# Altium schematic sheet GALX4-0047N_PCB-1109N_REV-A_io_2.SchDoc
size 431 x 279 mm; SheetNumber: 1; SheetTotal: 1; DocumentName: Sheet1.SCHDOC
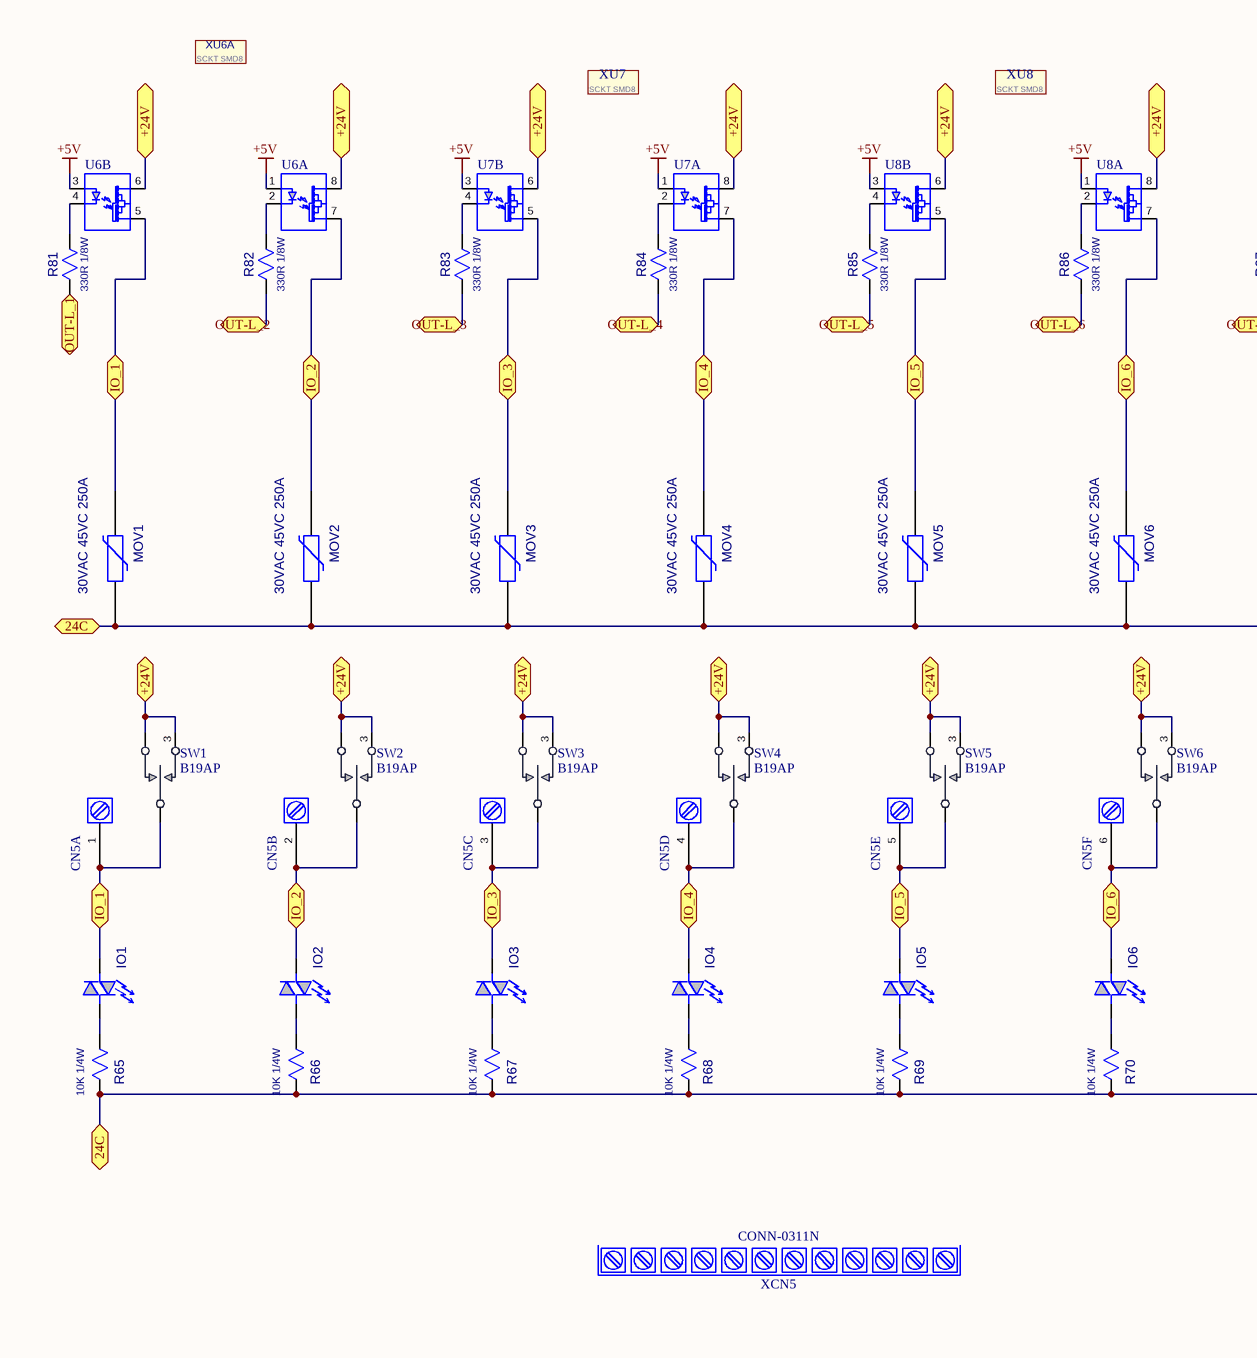
[diagram p0: GALX4-0047N_PCB-1109N_REV-A_io_2.SchDoc, left]
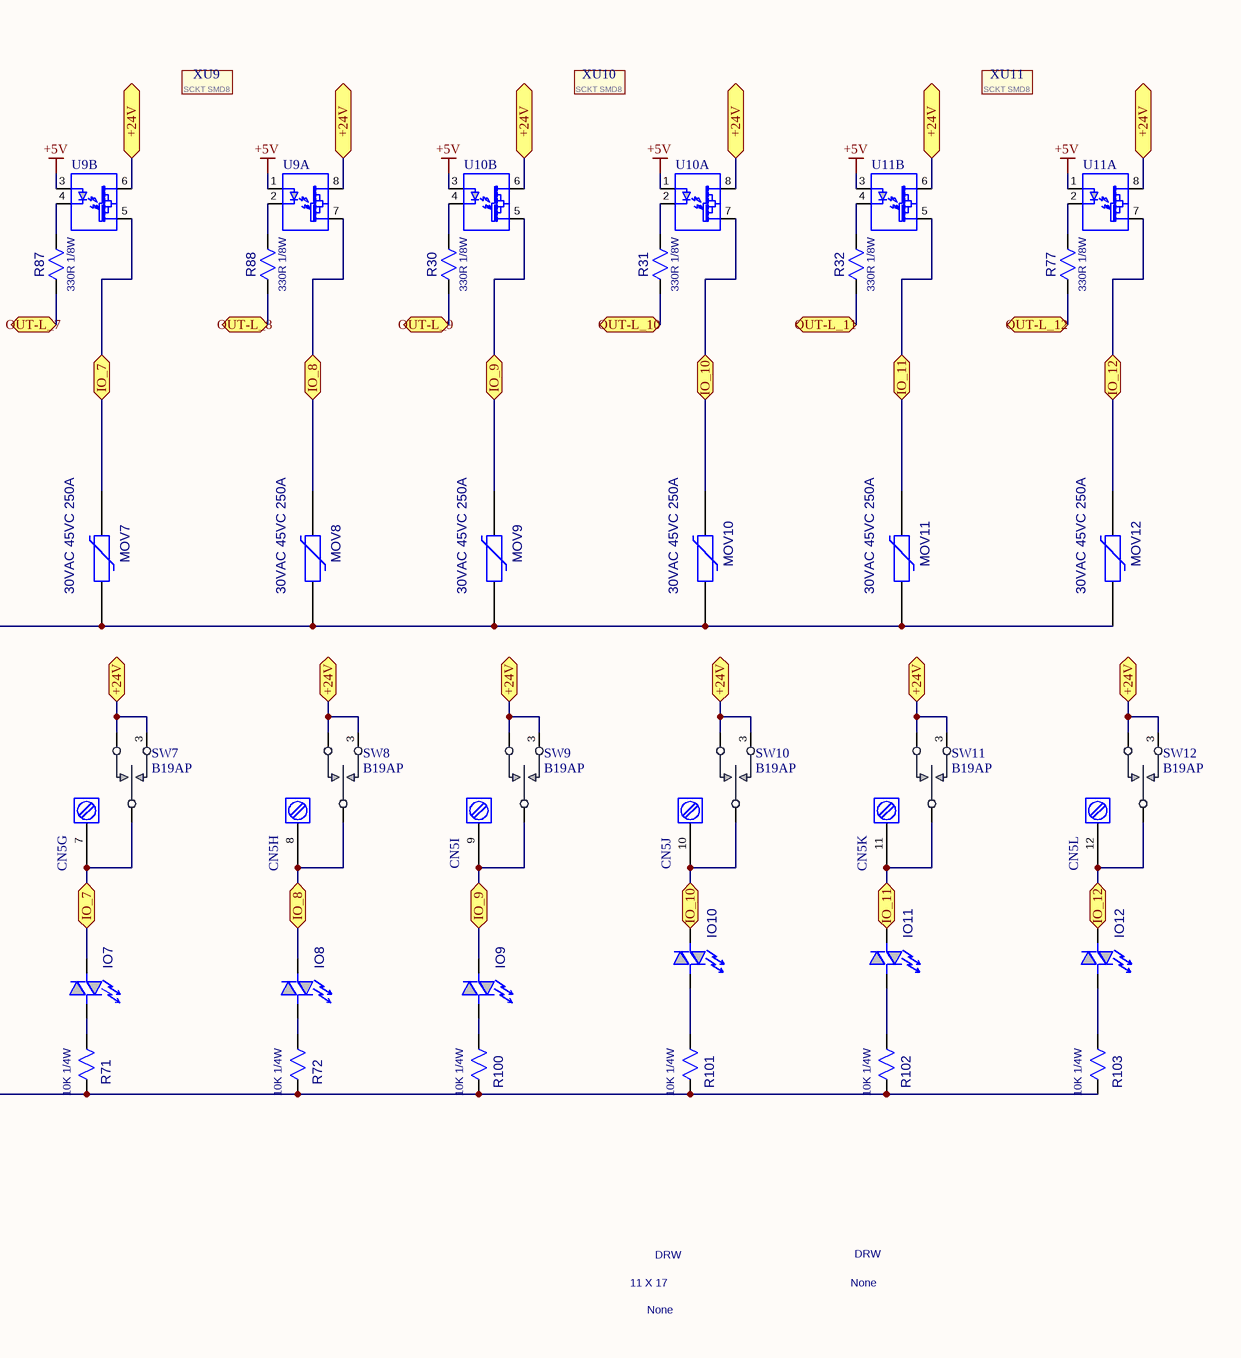
[diagram p1: GALX4-0047N_PCB-1109N_REV-A_io_2.SchDoc, right]

## Parts
CN5  CONN-0310N  [CNPIN-5MM-12P-NOSCR]  (value not drawn)  (parts A,B,C,D,E,F,G,H,I,J,K,L of 12)
IO1  LED-0013N  [1206-LED-GREEN]  (value not drawn)
IO2  LED-0013N  [1206-LED-GREEN]  (value not drawn)
IO3  LED-0013N  [1206-LED-GREEN]  (value not drawn)
IO4  LED-0013N  [1206-LED-GREEN]  (value not drawn)
IO5  LED-0013N  [1206-LED-GREEN]  (value not drawn)
IO6  LED-0013N  [1206-LED-GREEN]  (value not drawn)
IO7  LED-0013N  [1206-LED-GREEN]  (value not drawn)
IO8  LED-0013N  [1206-LED-GREEN]  (value not drawn)
IO9  LED-0013N  [1206-LED-GREEN]  (value not drawn)
IO10  LED-0013N  [1206-LED-GREEN]  (value not drawn)
IO11  LED-0013N  [1206-LED-GREEN]  (value not drawn)
IO12  LED-0013N  [1206-LED-GREEN]  (value not drawn)
MOV1  value 30VAC 45VC 250A  [DISC-280DX150WX200P]  (hidden comment: MOV-0012N)
MOV2  value 30VAC 45VC 250A  [DISC-280DX150WX200P]  (hidden comment: MOV-0012N)
MOV3  value 30VAC 45VC 250A  [DISC-280DX150WX200P]  (hidden comment: MOV-0012N)
MOV4  value 30VAC 45VC 250A  [DISC-280DX150WX200P]  (hidden comment: MOV-0012N)
MOV5  value 30VAC 45VC 250A  [DISC-280DX150WX200P]  (hidden comment: MOV-0012N)
MOV6  value 30VAC 45VC 250A  [DISC-280DX150WX200P]  (hidden comment: MOV-0012N)
MOV7  value 30VAC 45VC 250A  [DISC-280DX150WX200P]  (hidden comment: MOV-0012N)
MOV8  value 30VAC 45VC 250A  [DISC-280DX150WX200P]  (hidden comment: MOV-0012N)
MOV9  value 30VAC 45VC 250A  [DISC-280DX150WX200P]  (hidden comment: MOV-0012N)
MOV10  value 30VAC 45VC 250A  [DISC-280DX150WX200P]  (hidden comment: MOV-0012N)
MOV11  value 30VAC 45VC 250A  [DISC-280DX150WX200P]  (hidden comment: MOV-0012N)
MOV12  value 30VAC 45VC 250A  [DISC-280DX150WX200P]  (hidden comment: MOV-0012N)
R30  value 330R 1/8W  [0805]  (hidden comment: RES-0291N)
R31  value 330R 1/8W  [0805]  (hidden comment: RES-0291N)
R32  value 330R 1/8W  [0805]  (hidden comment: RES-0291N)
R65  value 10K 1/4W  [1206]  (hidden comment: RES-0294N)
R66  value 10K 1/4W  [1206]  (hidden comment: RES-0294N)
R67  value 10K 1/4W  [1206]  (hidden comment: RES-0294N)
R68  value 10K 1/4W  [1206]  (hidden comment: RES-0294N)
R69  value 10K 1/4W  [1206]  (hidden comment: RES-0294N)
R70  value 10K 1/4W  [1206]  (hidden comment: RES-0294N)
R71  value 10K 1/4W  [1206]  (hidden comment: RES-0294N)
R72  value 10K 1/4W  [1206]  (hidden comment: RES-0294N)
R77  value 330R 1/8W  [0805]  (hidden comment: RES-0291N)
R81  value 330R 1/8W  [0805]  (hidden comment: RES-0291N)
R82  value 330R 1/8W  [0805]  (hidden comment: RES-0291N)
R83  value 330R 1/8W  [0805]  (hidden comment: RES-0291N)
R84  value 330R 1/8W  [0805]  (hidden comment: RES-0291N)
R85  value 330R 1/8W  [0805]  (hidden comment: RES-0291N)
R86  value 330R 1/8W  [0805]  (hidden comment: RES-0291N)
R87  value 330R 1/8W  [0805]  (hidden comment: RES-0291N)
R88  value 330R 1/8W  [0805]  (hidden comment: RES-0291N)
R100  value 10K 1/4W  [1206]  (hidden comment: RES-0294N)
R101  value 10K 1/4W  [1206]  (hidden comment: RES-0294N)
R102  value 10K 1/4W  [1206]  (hidden comment: RES-0294N)
R103  value 10K 1/4W  [1206]  (hidden comment: RES-0294N)
SW1  ON-OFF-MON  [B19AP]  (value not drawn)
SW2  ON-OFF-MON  [B19AP]  (value not drawn)
SW3  ON-OFF-MON  [B19AP]  (value not drawn)
SW4  ON-OFF-MON  [B19AP]  (value not drawn)
SW5  ON-OFF-MON  [B19AP]  (value not drawn)
SW6  ON-OFF-MON  [B19AP]  (value not drawn)
SW7  ON-OFF-MON  [B19AP]  (value not drawn)
SW8  ON-OFF-MON  [B19AP]  (value not drawn)
SW9  ON-OFF-MON  [B19AP]  (value not drawn)
SW10  ON-OFF-MON  [B19AP]  (value not drawn)
SW11  ON-OFF-MON  [B19AP]  (value not drawn)
SW12  ON-OFF-MON  [B19AP]  (value not drawn)
U6  IC-0187N  [DIP8FORSMD]  (value not drawn)  (parts A,B of 2)
U7  IC-0187N  [DIP8FORSMD]  (value not drawn)  (parts A,B of 2)
U8  IC-0187N  [DIP8FORSMD]  (value not drawn)  (parts A,B of 2)
U9  IC-0187N  [DIP8FORSMD]  (value not drawn)  (parts A,B of 2)
U10  IC-0187N  [DIP8FORSMD]  (value not drawn)  (parts A,B of 2)
U11  IC-0187N  [DIP8FORSMD]  (value not drawn)  (parts A,B of 2)
XCN5  CONN-0311N  (mechanical)
XU6A  value SCKT SMD8  [SCKT-SMD8]  (hidden comment: SCKT-0028N)
XU7  value SCKT SMD8  [SCKT-SMD8]  (hidden comment: SCKT-0028N)
XU8  value SCKT SMD8  [SCKT-SMD8]  (hidden comment: SCKT-0028N)
XU9  value SCKT SMD8  [SCKT-SMD8]  (hidden comment: SCKT-0028N)
XU10  value SCKT SMD8  [SCKT-SMD8]  (hidden comment: SCKT-0028N)
XU11  value SCKT SMD8  [SCKT-SMD8]  (hidden comment: SCKT-0028N)

## Ports
24C, +24V (bidir), IO_1, IO_2, IO_3, IO_4, IO_5, IO_6, IO_7, IO_8, IO_9 (bidir), IO_10 (bidir), IO_11 (bidir), IO_12 (bidir), OUT-L_1, OUT-L_2, OUT-L_3, OUT-L_4, OUT-L_5, OUT-L_6, OUT-L_7, OUT-L_8, OUT-L_9 (bidir), OUT-L_10 (bidir), OUT-L_11 (bidir), OUT-L_12 (bidir)

## Nets
+5V: U6.1 U6.3 U7.1 U7.3 U8.1 U8.3 U9.1 U9.3 U10.1 U10.3 U11.1 U11.3
24C: MOV1.2 MOV2.2 MOV3.2 MOV4.2 MOV5.2 MOV6.2 MOV7.2 MOV8.2 MOV9.2 MOV10.2 MOV11.2 MOV12.2 R65.2 R66.2 R67.2 R68.2 R69.2 R70.2 R71.2 R72.2 R100.2 R101.2 R102.2 R103.2 ; port 24C
+24V: SW1.1 SW1.3(MON) SW2.1 SW2.3(MON) SW3.1 SW3.3(MON) SW4.1 SW4.3(MON) SW5.1 SW5.3(MON) SW6.1 SW6.3(MON) SW7.1 SW7.3(MON) SW8.1 SW8.3(MON) SW9.1 SW9.3(MON) SW10.1 SW10.3(MON) SW11.1 SW11.3(MON) SW12.1 SW12.3(MON) U6.6 U6.8 U7.6 U7.8 U8.6 U8.8 U9.6 U9.8 U10.6 U10.8 U11.6 U11.8 ; port +24V
IO_1: CN5.1 IO1.1 MOV1.1 SW1.2 U6.5 ; port IO_1
IO_2: CN5.2 IO2.1 MOV2.1 SW2.2 U6.7 ; port IO_2
IO_3: CN5.3 IO3.1 MOV3.1 SW3.2 U7.5 ; port IO_3
IO_4: CN5.4 IO4.1 MOV4.1 SW4.2 U7.7 ; port IO_4
IO_5: CN5.5 IO5.1 MOV5.1 SW5.2 U8.5 ; port IO_5
IO_6: CN5.6 IO6.1 MOV6.1 SW6.2 U8.7 ; port IO_6
IO_7: CN5.7 IO7.1 MOV7.1 SW7.2 U9.5 ; port IO_7
IO_8: CN5.8 IO8.1 MOV8.1 SW8.2 U9.7 ; port IO_8
IO_9: CN5.9 IO9.1 MOV9.1 SW9.2 U10.5 ; port IO_9
IO_10: CN5.10 IO10.1 MOV10.1 SW10.2 U10.7 ; port IO_10
IO_11: CN5.11 IO11.1 MOV11.1 SW11.2 U11.5 ; port IO_11
IO_12: CN5.12 IO12.1 MOV12.1 SW12.2 U11.7 ; port IO_12
OUT-L_1: R81.1 ; port OUT-L_1
OUT-L_2: R82.1 ; port OUT-L_2
OUT-L_3: R83.1 ; port OUT-L_3
OUT-L_4: R84.1 ; port OUT-L_4
OUT-L_5: R85.1 ; port OUT-L_5
OUT-L_6: R86.1 ; port OUT-L_6
OUT-L_7: R87.1 ; port OUT-L_7
OUT-L_8: R88.1 ; port OUT-L_8
OUT-L_9: R30.1 ; port OUT-L_9
OUT-L_10: R31.1 ; port OUT-L_10
OUT-L_11: R32.1 ; port OUT-L_11
OUT-L_12: R77.1 ; port OUT-L_12
NetIO1_2: IO1.2 R65.1
NetIO2_2: IO2.2 R66.1
NetIO3_2: IO3.2 R67.1
NetIO4_2: IO4.2 R68.1
NetIO5_2: IO5.2 R69.1
NetIO6_2: IO6.2 R70.1
NetIO7_2: IO7.2 R71.1
NetIO8_2: IO8.2 R72.1
NetIO9_2: IO9.2 R100.1
NetIO10_2: IO10.2 R101.1
NetIO11_2: IO11.2 R102.1
NetIO12_2: IO12.2 R103.1
NetR30_2: R30.2 U10.4
NetR31_2: R31.2 U10.2
NetR32_2: R32.2 U11.4
NetR77_2: R77.2 U11.2
NetR81_2: R81.2 U6.4
NetR82_2: R82.2 U6.2
NetR83_2: R83.2 U7.4
NetR84_2: R84.2 U7.2
NetR85_2: R85.2 U8.4
NetR86_2: R86.2 U8.2
NetR87_2: R87.2 U9.4
NetR88_2: R88.2 U9.2

## Notes on the sheet
- DRW
- 11 X 17
- None
- TITLE:
- S
- DWG BY
- E
- L
- V
- A
- T
- O
- R
- D
- I
- C
- 50 EAST 153rd STREET
- ENGINEER
- DWG. No.
- BRONX, N.Y. 10451
- REV
- DESCRIPTION
- ECN NO.
- DATE
- SIZE
- SCALE
- PART No.
- FILE NAME
- SHEET __ 0F __
- REV.

## Library data of the parts
CN5 = CONN-0310N: CNPIN_5MM_12P; MFG PART ID: 1933286; MANUFACTURER: PHOENIX; Value: 300V 10A; GAL DESC.: CONN,HEAD-M 12POS 5MMP 13MMH PTP REFLOW; PLACE: PTP; UNIT $: $0.4000; VENDOR ID: *; GAL P/N: CONN-0310N; PART TYPE: CONN-0310N; VENDOR: *
IO1-IO12 = LED-0013N: LED-1206-BI-G; MANUFACTURER: SUNLED; MFG PART ID: XZSGKSGK55W-7; Value: GREEN; GAL DESC.: LED,GREEN BI-POLAR DOME LENS 1206 SMT; PLACE: S; UNIT $: $0.2260; GAL P/N: LED-0013N; PART TYPE: 1206LED; VENDOR: SUNLED; VENDOR ID: LED-0013N
MOV1-MOV12 = MOV-0012N: MOV-30VAC-45VC-250A-7MM-STRAIGHT; MANUFACTURER: LITTLEFUSE; MFG PART ID: V47ZU1P; GAL DESC.: MOV,BI TVS 7MM 30VAC 38VDC 250A UCRMP; PLACE: R; UNIT $: $0.1350; SLOT: 00023; SPAN: 00200; GAL P/N: MOV-0012N; PART TYPE: DISC-7MM-STRAIGHT; VENDOR: *; VENDOR ID: *
R30-R32 R77 R81-R88 = RES-0291N: R-0805-A-330R-1/8-5%; MANUFACTURER: KOA SPEER; MFG PART ID: RK73B2ATTD331J; PLACE: S; GAL DESC.: RESISTOR,330OHM 1/8W 5% 0805 SMT; UNIT $: $0.0038; GAL P/N: RES-0291N; PART TYPE: 0805; VENDOR: *; VENDOR ID: *
R65-R72 R100-R103 = RES-0294N: R-1206-B-10K-1/4-1%; MANUFACTURER: VISHAY/DALE; MFG PART ID: CRCW120610K0FKEA; PLACE: S; GAL DESC.: RESISTOR,10KOHM 1/4W 1% 1206 SMT; UNIT $: $0.0090; GAL P/N: RES-0294N; PART TYPE: 1206; VENDOR: *; VENDOR ID: *
SW1-SW12 = SW-0083N: SWITCH,MOMENTARY TOGGLE; MANUFACTURER: NKK; GAL DESC.: SWITCH,MINIATURE TOGGLE ON-OFF-MON; PLACE: R; UNIT $: 1.057474; VENDOR: ARROW ELECTRONICS, INC.; GAL P/N: SW-0083N; PART TYPE: SW; VENDOR ID: SW-0083N; MFG PART ID: B19AP
U6-U11 = IC-0187N: SSR-2CHFET-60V-0.5A-DIP8; MANUFACTURER: PANASONIC; MFG PART ID: AQW212; VENDOR: EQUIPTEX; PLACE: D; UNIT $: $1.8900; GAL DESC.: IC, PHOTOMOS 2CH SSR 60V 0.5A 8DIP; REPAIR: -00002; SLOT: 00322; GAL P/N: IC-0187N; PART TYPE: DIP8; DEPTH: +00001
XCN5 = CONN-0311N: CN_5MM_12P_LABELED_PLUG(BOM); MFG PART ID: PT 1.5/12-PH-5.0 BD:1-12; MANUFACTURER: PHOENIX; Value: 250V 10A; GAL DESC.: CONN,PLUG-F 12POS 5MMP SCRW LABELS 1-12; PLACE: PW; UNIT $: $1.7000; GAL P/N: CONN-0311N; PART TYPE: CONN-0311N
XU6A XU7-XU11 = SCKT-0028N: SOCKET_SMD8; MANUFACTURER: MILL-MAX; MFG PART ID: 214-44-308-01-670800; UNIT $: $0.5000; PLACE: S; GAL DESC.: SOCKET,8 PIN CLOSED FRAME 8SMD SMT; VENDOR: *; PART TYPE: SCKT_SMD8; GAL P/N: SCKT-0028N; VENDOR ID: *